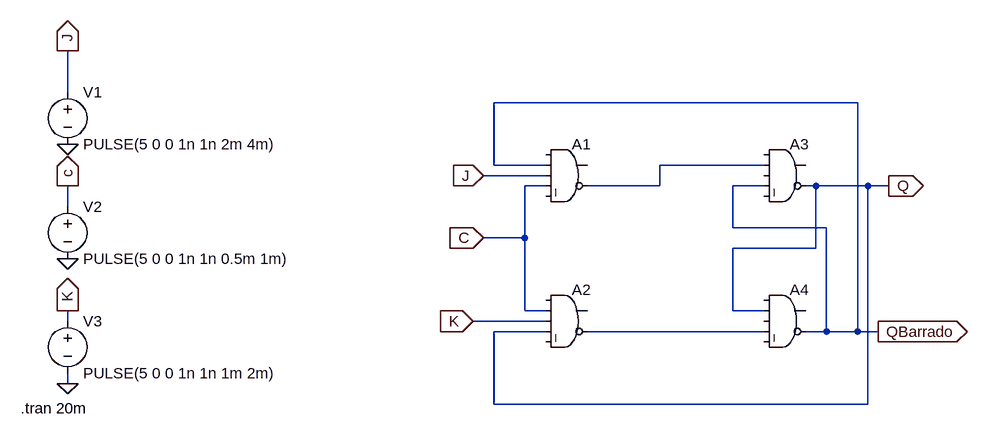
[diagram p0: schematic tentativa flipflop jk.asc]
tentativa flipflop jk.asc, the LTspice schematic file:
Version 4
SHEET 1 880 680
WIRE -1616 -528 -1616 -592
WIRE -400 -512 -960 -512
WIRE -960 -416 -960 -512
WIRE -880 -416 -960 -416
WIRE -544 -416 -704 -416
WIRE -880 -400 -976 -400
WIRE -880 -384 -912 -384
WIRE -704 -384 -704 -416
WIRE -704 -384 -816 -384
WIRE -544 -384 -592 -384
WIRE -464 -384 -480 -384
WIRE -384 -384 -464 -384
WIRE -352 -384 -384 -384
WIRE -1616 -352 -1616 -384
WIRE -592 -320 -592 -384
WIRE -448 -320 -592 -320
WIRE -912 -304 -912 -384
WIRE -912 -304 -976 -304
WIRE -464 -288 -464 -384
WIRE -464 -288 -592 -288
WIRE -912 -192 -912 -304
WIRE -880 -192 -912 -192
WIRE -592 -192 -592 -288
WIRE -544 -192 -592 -192
WIRE -1616 -176 -1616 -192
WIRE -880 -176 -992 -176
WIRE -880 -160 -960 -160
WIRE -544 -160 -816 -160
WIRE -448 -160 -448 -320
WIRE -448 -160 -480 -160
WIRE -400 -160 -400 -512
WIRE -400 -160 -448 -160
WIRE -368 -160 -400 -160
WIRE -1616 -80 -1616 -96
WIRE -960 -48 -960 -160
WIRE -384 -48 -384 -384
WIRE -384 -48 -960 -48
FLAG -1616 -448 0
FLAG -1616 -272 0
FLAG -1616 -80 0
FLAG -352 -384 Q
IOPIN -352 -384 Out
FLAG -368 -160 QBarrado
IOPIN -368 -160 Out
FLAG -1616 -592 J
IOPIN -1616 -592 Out
FLAG -976 -400 J
IOPIN -976 -400 In
FLAG -1616 -384 c
IOPIN -1616 -384 Out
FLAG -976 -304 C
IOPIN -976 -304 In
FLAG -1616 -192 K
IOPIN -1616 -192 Out
FLAG -992 -176 K
IOPIN -992 -176 In
SYMBOL voltage -1616 -544 R0
WINDOW 123 0 0 Left 0
WINDOW 39 0 0 Left 0
SYMATTR InstName V1
SYMATTR Value PULSE(5 0 0 1n 1n 2m 4m)
SYMBOL voltage -1616 -368 R0
WINDOW 123 0 0 Left 0
WINDOW 39 0 0 Left 0
SYMATTR InstName V2
SYMATTR Value PULSE(5 0 0 1n 1n 0.5m 1m)
SYMBOL voltage -1616 -192 R0
WINDOW 123 0 0 Left 0
WINDOW 39 0 0 Left 0
SYMATTR InstName V3
SYMATTR Value PULSE(5 0 0 1n 1n 1m 2m)
SYMBOL Digital\\and -848 -464 R0
SYMATTR InstName A1
SYMBOL Digital\\and -848 -240 R0
SYMATTR InstName A2
SYMBOL Digital\\and -512 -464 R0
SYMATTR InstName A3
SYMBOL Digital\\and -512 -240 R0
SYMATTR InstName A4
TEXT -1688 -42 Left 2 !.tran 20m

The netlist it stands for:
* tentativa flipflop jk.asc
V1 J 0 PULSE(5 0 0 1n 1n 2m 4m)
V2 c 0 PULSE(5 0 0 1n 1n 0.5m 1m)
V3 K 0 PULSE(5 0 0 1n 1n 1m 2m)
A1 0 QBarrado J c 0 N001 0 0 AND
A2 0 c K Q 0 N002 0 0 AND
A3 0 N001 0 QBarrado 0 Q 0 0 AND
A4 0 Q 0 N002 0 QBarrado 0 0 AND
.tran 20m
.backanno
.end